# Altium schematic sheet Input Buttons.SchDoc
size A4
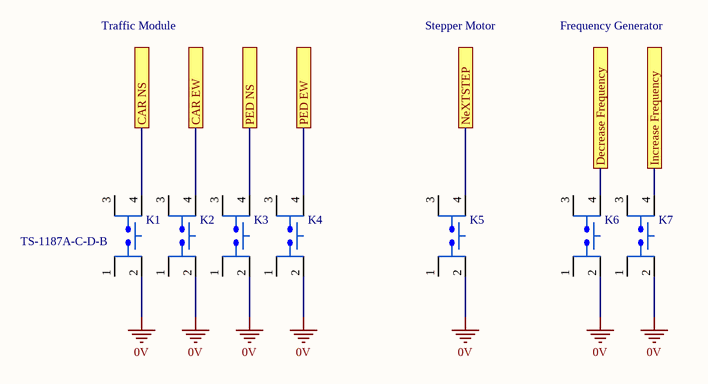
[diagram p0: Input Buttons.SchDoc]

## Parts
K1  TS-1187A-C-D-B  [XKB SW-4.5]
K2  TS-1187A-C-D-B  [XKB SW-4.5]  (value not drawn)
K3  TS-1187A-C-D-B  [XKB SW-4.5]  (value not drawn)
K4  TS-1187A-C-D-B  [XKB SW-4.5]  (value not drawn)
K5  TS-1187A-C-D-B  [XKB SW-4.5]  (value not drawn)
K6  TS-1187A-C-D-B  [XKB SW-4.5]  (value not drawn)
K7  TS-1187A-C-D-B  [XKB SW-4.5]  (value not drawn)

## Ports
CAR EW, CAR NS, Decrease Frequency, Increase Frequency, NeXTSTEP, PED EW, PED NS

## Nets
0V: K1.2(VDD) K2.2(VDD) K3.2(VDD) K4.2(VDD) K5.2(VDD) K6.2(VDD) K7.2(VDD)
CAR EW: K2.4(VDD) ; port CAR EW
CAR NS: K1.4(VDD) ; port CAR NS
Decrease Frequency: K6.4(VDD) ; port Decrease Frequency
Increase Frequency: K7.4(VDD) ; port Increase Frequency
NeXTSTEP: K5.4(VDD) ; port NeXTSTEP
PED EW: K4.4(VDD) ; port PED EW
PED NS: K3.4(VDD) ; port PED NS

Not connected (* = marked no-connect by the designer): K1 1(VDD) 3(VDD); K2 1(VDD) 3(VDD); K3 1(VDD) 3(VDD); K4 1(VDD) 3(VDD); K5 1(VDD) 3(VDD); K6 1(VDD) 3(VDD); K7 1(VDD) 3(VDD)

## Notes on the sheet
- Traffic Module
- Stepper Motor
- Frequency Generator
- Title
- Size:
- Date:
- A4
- Number:
- Time:
- Revision:
- Sheet
- of
- File:

## Library data of the parts
K1-K7 = TS-1187A-C-D-B: TACTILE SWITCHES SPST 5.10MM X 5.10MM 0.80MM SMD ROHS; Manufacturer: XKB Enerprise; Part Number: TS-1187A-C-D-B; Digikey Link: https://jlcpcb.com/client/index.html#/parts/componentSearch?searchTxt=usb